# EAGLE design rgbSensor (EAGLE 7.7.0)
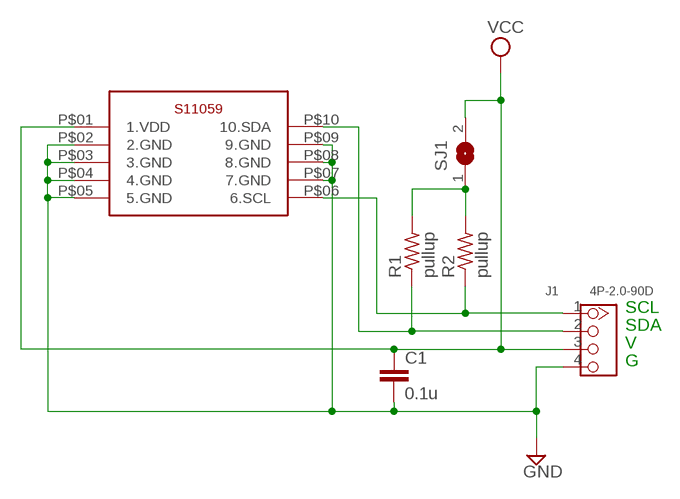
[diagram p0: schematic, sheet 1]

## Parts
C1  0.1u  C-EUC0603  [C0603]
J1  4P-2.0-90D  GROVE-CONNECTOR-DIP-90D(4P-2.0)  [HW4-2.0-90D]
R1  pullup  R-US_R0603  [R0603]
R2  pullup  R-US_R0603  [R0603]
SJ1  SJ  [SJ]
U$1  S11059  [S11059-2DT]

## Nets
GND: C1.2 J1.4 U$1.P$02(2.GND) U$1.P$03(3.GND) U$1.P$04(4.GND) U$1.P$05(5.GND) U$1.P$07(7.GND) U$1.P$08(8.GND) U$1.P$09(9.GND)
N$2: J1.2 R1.1 U$1.P$10(10.SDA)
N$3: R1.2 R2.2 SJ1.1
N$4: J1.1 R2.1 U$1.P$06(6.SCL)
VCC: C1.1 J1.3 SJ1.2 U$1.P$01(1.VDD)

## Notes on the sheet
- SCL
- SDA
- V
- G

## Library data of the parts
C1 = 0my:C-EU: CAPACITOR, European symbol
J1 = Seeed-OPL-Connector:GROVE-CONNECTOR-DIP-90D(4P-2.0): 320110034
R1 R2 = 0my:R-US_: RESISTOR, American symbol
SJ1 = jumper:SJ: SMD solder JUMPER
U$1 = 0-chirimen:S11059

## Net classes
0 default: width 0.33 mm, drill 0.178 mm, clearance 0.152 mm
1 VCC: width 0.508 mm, drill 0.178 mm, clearance 0.152 mm
2 GND: width 0.508 mm, drill 0.178 mm, clearance 0.152 mm

## Board
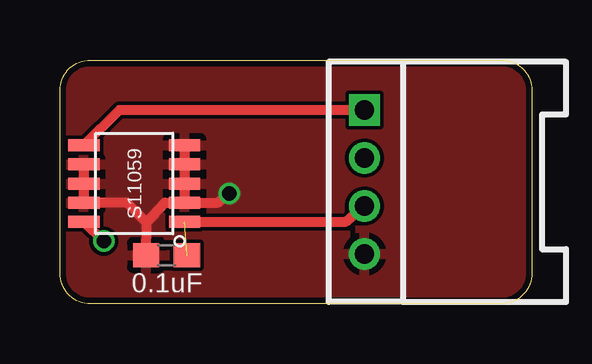
[diagram p1: board, top side]
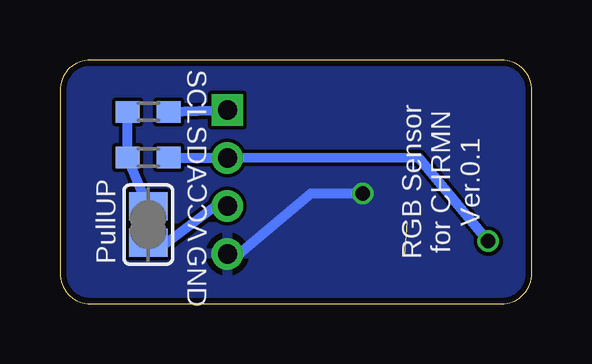
[diagram p2: board, bottom side, seen from below]

Size 19.68 x 10.16 mm. Coordinates in mm from the lower left corner, seen from the top.
Outline: 1.27,10.16 18.41,10.16 arc-90 19.68,8.89 19.68,1.27 arc-90 18.41,0 1.27,0 arc-90 0,1.27 0,8.89 arc-90 1.27,10.16
Copper layers (1*16): Top 0.035mm / dielectric 1.5mm / Bottom 0.035mm
Design rules "Elecrow_2-layer_eagle_rule": minimum track width 6mil, minimum drill 12mil, track to track 6mil, track to pad 6mil, pad to pad 6mil, via to via 6mil, smd to smd 0mil, copper to edge 10mil, drill to drill 10mil, minimum pad ring 10mil, minimum via ring 6mil, stop-mask expansion 2mil, vias tented up to drill 100mil, thermal gap 10mil

### Footprints (pad centres in the part's own frame; a part is rotated, then mirrored left to right if it is on the bottom)
C0603 = smd 1.1 x 1: 1 -0.85,0; 2 0.85,0
HW4-2.0-90D = drill 0.8 pad 1.27 square: 1 -3,0 | drill 0.8 pad 1.27: 2 -1,0; 3 1,0; 4 3,0
R0603 = smd 1 x 0.9: 1 -0.85,0; 2 0.85,0
SJ = smd 1.168 x 1.6: 1 -0.762,0; 2 0.762,0
S11059-2DT = smd 1.3 x 0.5: P$01 -0.5,3.7; P$02 -0.5,2.9; P$03 -0.5,2.1; P$04 -0.5,1.3; P$05 -0.5,0.5; P$06 3.7,0.5; P$07 3.7,1.3; P$08 3.7,2.1; P$09 3.7,2.9; P$10 3.7,3.7

### Placement (x,y rotation side)
C1  4.45,2.03 180 top
J1  12.7,5.08 270 top
R1  16,6.1 180 bottom
R2  16,8 180 bottom
SJ1  16,3.3 270 bottom
U$1  4.7,7.11 180 top

### Tracks (layer width: path | path; a pad name or v marks a point on that pad's centre or on a via)
GND  (via drill 0.6)
  Top 0.406: U$1.P$05 U$1.P$04 U$1.P$03 U$1.P$02 | U$1.P$07 U$1.P$08 U$1.P$09 2.79,4.22 3.61,3.38 C1.2 3.61,3.4 4.37,4.22 U$1.P$02 | U$1.P$02 6.58,4.22 v7.06,4.6
  Bottom 0.406: v7.06,4.6 9.22,4.6 12.19,2.08 J1.4
  pour Bottom: -0.64,10.16 20.32,10.16 20.32,0 -0.64,0
  pour Top: -0.64,10.16 20.32,10.16 20.32,0 -0.64,0
N$2  (via drill 0.6)
  Top 0.406: U$1.P$10 v1.83,2.62
  Bottom 0.406: R1.1 J1.2 4.7,6.07 v1.83,2.62
N$3
  Bottom 0.406: SJ1.1 R1.2 R2.2
N$4
  Top 0.406: U$1.P$06 2.49,8.08 J1.1
  Bottom 0.406: R2.1 J1.1
VCC  (1 unrouted)
  Top 0.406: U$1.P$01 11.94,3.43 J1.3
  Bottom 0.406: SJ1.2 15.24,2.54 13.21,4.06 J1.3

### Text on the board
tNames: 0.1uF
bNames: SCL | SDA | RGB Sensor / for CHRMN / Ver.0.1 | VCC | PullUP | GND